# EAGLE design RPiCanInterface (EAGLE 6.4)
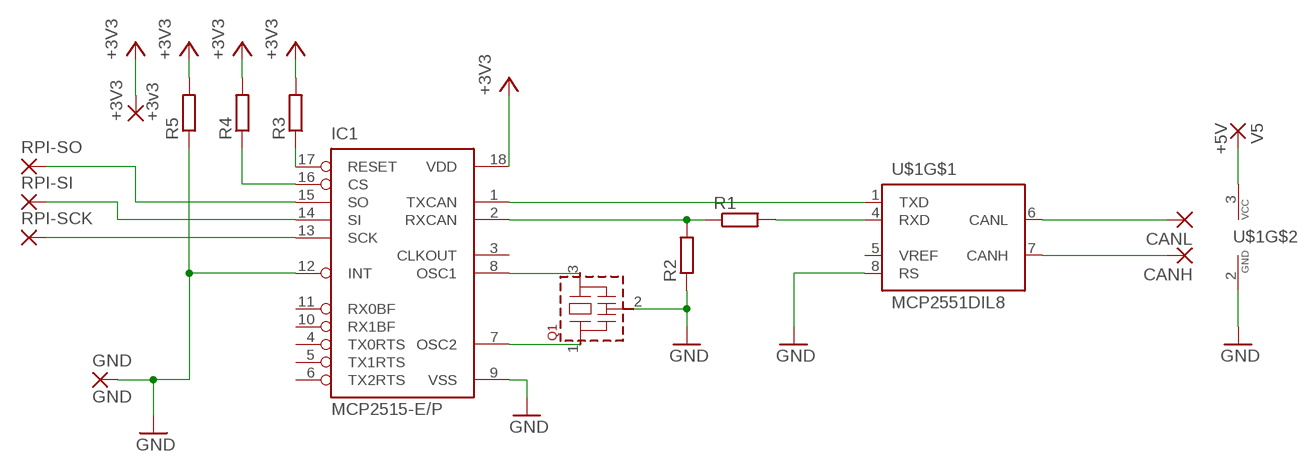
[diagram p0: schematic, sheet 1]

## Parts
+3V3  +3v3  1,6/0,8  [1,6/0,8]
CANH  1,6/0,8  [1,6/0,8]
CANL  1,6/0,8  [1,6/0,8]
GND  GND  1,6/0,8  [1,6/0,8]
IC1  MCP2515-E/P  [DIL18]
Q1  CSTLA_T  [CSTLA_T]
R1  R-EU_0207/7  [0207/7]
R2  R-EU_0207/7  [0207/7]
R3  R-EU_0207/7  [0207/7]
R4  R-EU_0207/7  [0207/7]
R5  R-EU_0207/7  [0207/7]
RPI-SCK  1,6/0,8  [1,6/0,8]
RPI-SI  1,6/0,8  [1,6/0,8]
RPI-SO  1,6/0,8  [1,6/0,8]
U$1  MCP2551DIL8  [DIL08]
V5  +5V  1,6/0,8  [1,6/0,8]

## Nets
GND: GND.1(P) IC1.9(VSS) IC1.12(INT) Q1.2(VSS) R2.1 R5.1 U$1.2(GND) U$1.8(RS)
N$1: IC1.1(TXCAN) U$1.1(TXD)
N$2: IC1.2(RXCAN) R1.1 R2.2
N$3: R1.2 U$1.4(RXD)
N$4: IC1.7(OSC2) Q1.1
N$5: IC1.8(OSC1) Q1.3
N$6: CANL.1(P) U$1.6(CANL)
N$7: CANH.1(P) U$1.7(CANH)
N$8: IC1.17(RESET) R3.1
N$9: IC1.16(CS) R4.1
N$10: IC1.15(SO) RPI-SO.1(P)
N$11: IC1.14(SI) RPI-SI.1(P)
N$12: IC1.13(SCK) RPI-SCK.1(P)
N$13: U$1.3(VCC) V5.1(P)
VCC: +3V3.1(P) IC1.18(VDD) R3.2 R4.2 R5.2 ; supply symbol labelled +3V3
Unconnected: IC1.3(CLKOUT) IC1.4(TX0RTS) IC1.5(TX1RTS) IC1.6(TX2RTS) IC1.10(RX1BF) IC1.11(RX0BF) U$1.5(VREF)

## Library data of the parts
+3V3 CANH CANL GND RPI-SCK RPI-SI RPI-SO V5 = wirepad:1,6/0,8: THROUGH-HOLE PAD
IC1 = mcp2515:MCP2515
Q1 = murata-resonators:CSTLA_T: Ceramic resonator 10.01 to 13.00 MHz
R1-R5 = rcl:R-EU_: RESISTOR, European symbol
U$1 = can:MCP2551: CAN Tranceiver Microchip

## Board
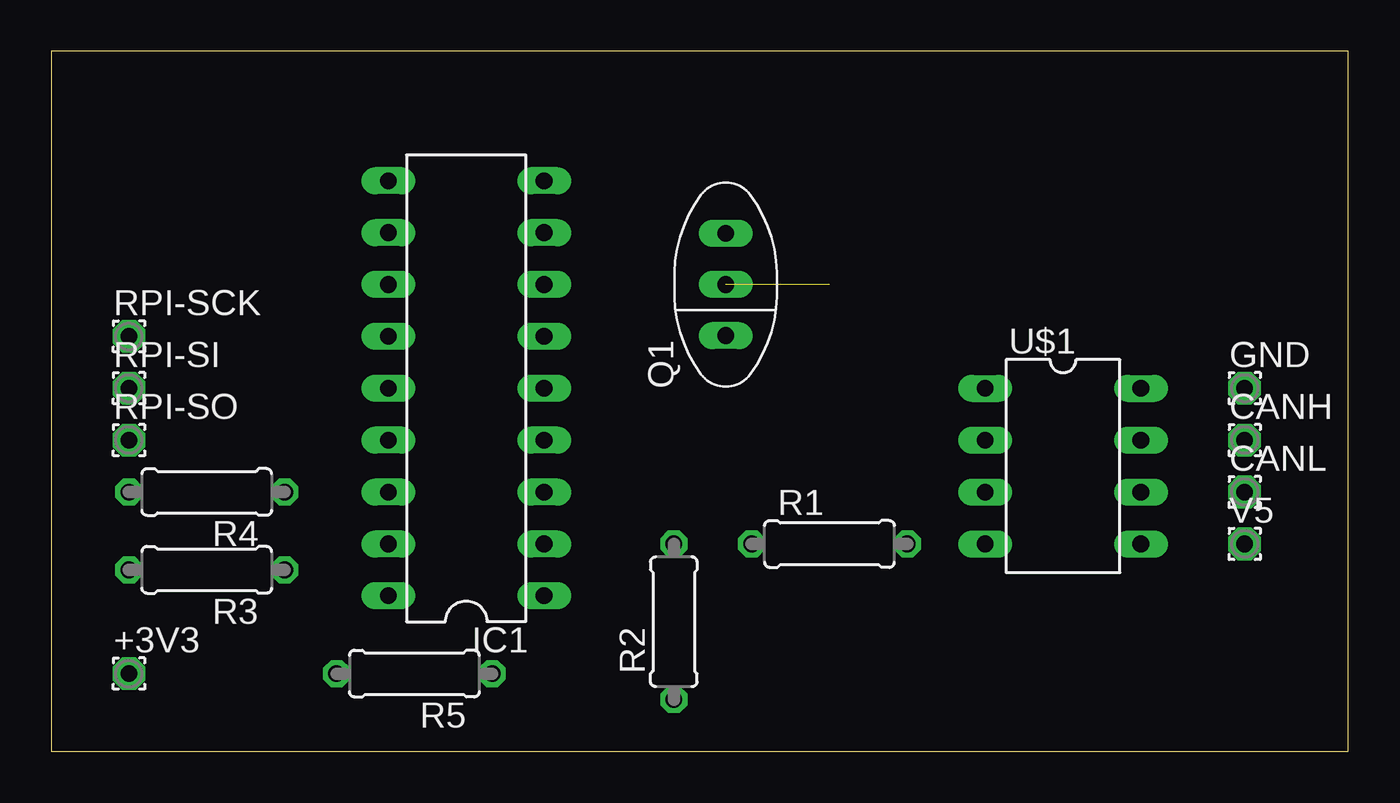
[diagram p1: board, top side]
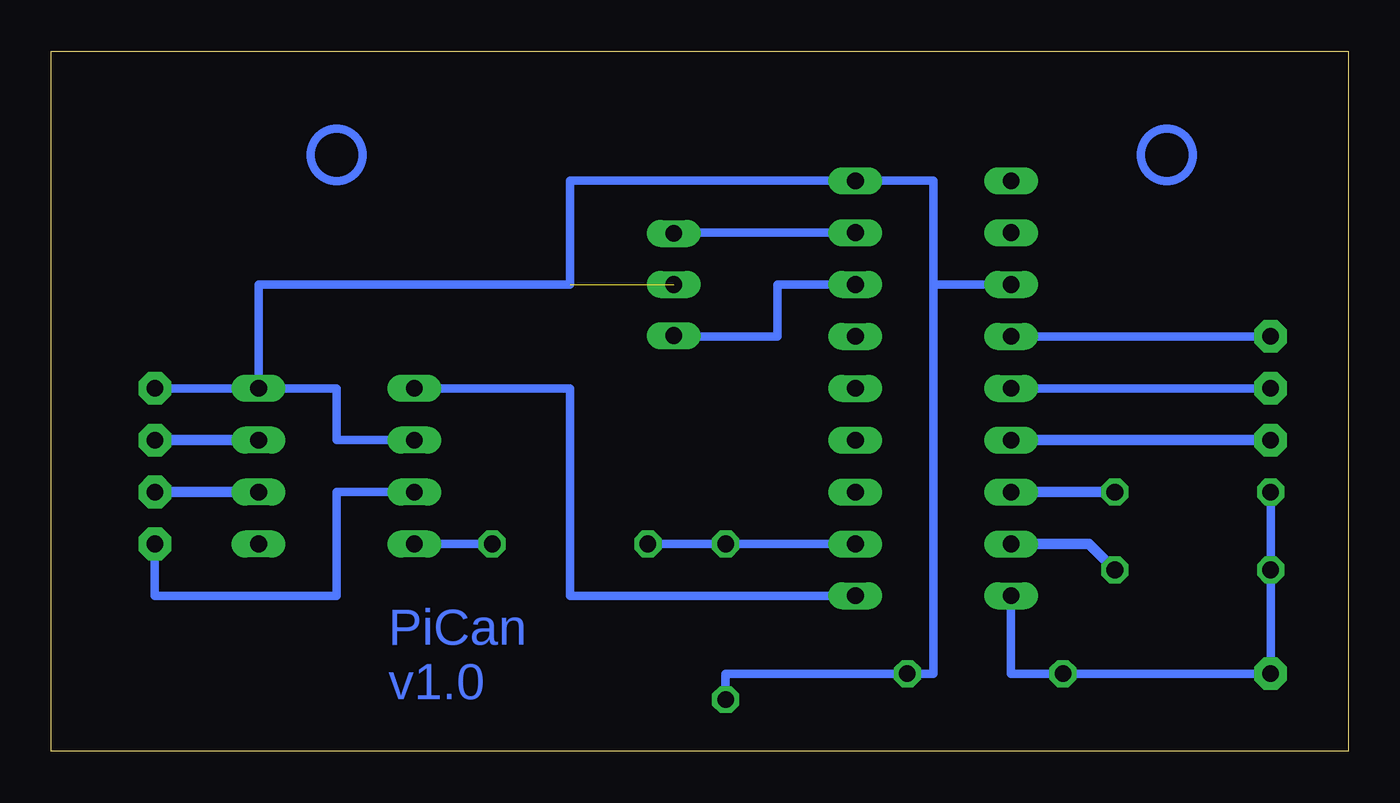
[diagram p2: board, bottom side, seen from below]

Size 63.5 x 34.29 mm. Coordinates in mm from the lower left corner, seen from the top.
Outline: 0,0 63.5,0 63.5,34.29 0,34.28 0,0
Copper layers (1*16): Top 0.035mm / dielectric 1.5mm / Bottom 0.035mm
Design rules "default *": minimum track width 20mil, minimum drill 24mil, track to track 8mil, track to pad 8mil, pad to pad 8mil, via to via 8mil, smd to smd 8mil, copper to edge 40mil, drill to drill 8mil, minimum pad ring 10mil, minimum via ring 8mil, stop-mask expansion 4mil, vias tented up to drill 0mil, thermal gap 10mil

### Footprints (pad centres in the part's own frame; a part is rotated, then mirrored left to right if it is on the bottom)
1,6/0,8 = drill 0.813 pad 1.6 octagon: 1 0,0
DIL18 = drill 0.813 long: 1 -10.16,-3.81; 2 -7.62,-3.81; 3 -5.08,-3.81; 4 -2.54,-3.81; 5 0,-3.81; 6 2.54,-3.81; 7 5.08,-3.81; 8 7.62,-3.81; 9 10.16,-3.81; 10 10.16,3.81; 11 7.62,3.81; 12 5.08,3.81; 13 2.54,3.81; 14 0,3.81; 15 -2.54,3.81; 16 -5.08,3.81; 17 -7.62,3.81; 18 -10.16,3.81
CSTLA_T = drill 0.813 long: 1 -2.5,0; 2 0,0; 3 2.5,0
0207/7 = drill 0.813 octagon: 1 -3.81,0; 2 3.81,0
DIL08 = drill 0.813 long: 1 -3.81,-3.81; 2 -1.27,-3.81; 3 1.27,-3.81; 4 3.81,-3.81; 5 3.81,3.81; 6 1.27,3.81; 7 -1.27,3.81; 8 -3.81,3.81

### Placement (x,y rotation side)
+3V3  3.81,3.81 0 top
CANH  58.42,15.24 0 top
CANL  58.42,12.7 0 top
GND  58.42,17.78 0 top
IC1  20.32,17.78 90 top
Q1  33.02,22.86 90 top
R1  38.1,10.16 0 top
R2  30.48,6.35 90 top
R3  7.62,8.89 180 top
R4  7.62,12.7 180 top
R5  17.78,3.81 180 top
RPI-SCK  3.81,20.32 0 top
RPI-SI  3.81,17.78 0 top
RPI-SO  3.81,15.24 0 top
U$1  49.53,13.97 270 top
V5  58.42,10.16 0 top

### Tracks (layer width: path | path; a pad name or v marks a point on that pad's centre or on a via)
GND  (1 unrouted)
  Bottom 0.406: IC1.12 20.32,22.86 | 20.32,22.86 20.32,3.81 R5.1 30.48,3.81 R2.1 | U$1.8 GND.1 | 20.32,22.86 20.32,27.94 IC1.9 38.1,27.94 38.1,22.86 53.34,22.86 U$1.8 | U$1.2 49.53,15.24 49.53,17.78 U$1.8
N$1
  Bottom 0.406: IC1.1 38.1,7.62 38.1,17.78 U$1.1
N$2
  Bottom 0.406: IC1.2 R2.2 R1.1
N$3
  Bottom 0.406: R1.2 U$1.4
N$4
  Bottom 0.406: IC1.7 27.94,22.86 27.94,20.32 33.02,20.32 Q1.1
N$5
  Bottom 0.406: IC1.8 33.02,25.4 Q1.3
N$6
  Bottom 0.508: CANL.1 U$1.6
N$7
  Bottom 0.508: CANH.1 U$1.7
N$8
  Bottom 0.508: R3.1 12.7,10.16 IC1.17
N$9
  Bottom 0.508: IC1.16 R4.1
N$10
  Bottom 0.508: RPI-SO.1 IC1.15
N$11
  Bottom 0.406: IC1.14 RPI-SI.1
N$12
  Bottom 0.406: IC1.13 RPI-SCK.1
N$13
  Bottom 0.406: U$1.3 49.53,12.7 49.53,7.62 58.42,7.62 V5.1
VCC
  Bottom 0.406: IC1.18 16.51,3.81 R5.2 +3V3.1 R3.2 R4.2
(copper drawn outside any net)
  shapes: Bottom circle x2

### Text on the board
Bottom: PiCan / v1.0